# Altium schematic sheet [10] - CONNECTOR.SchDoc
size A4; Size: A4; Contact: datasystem.pl
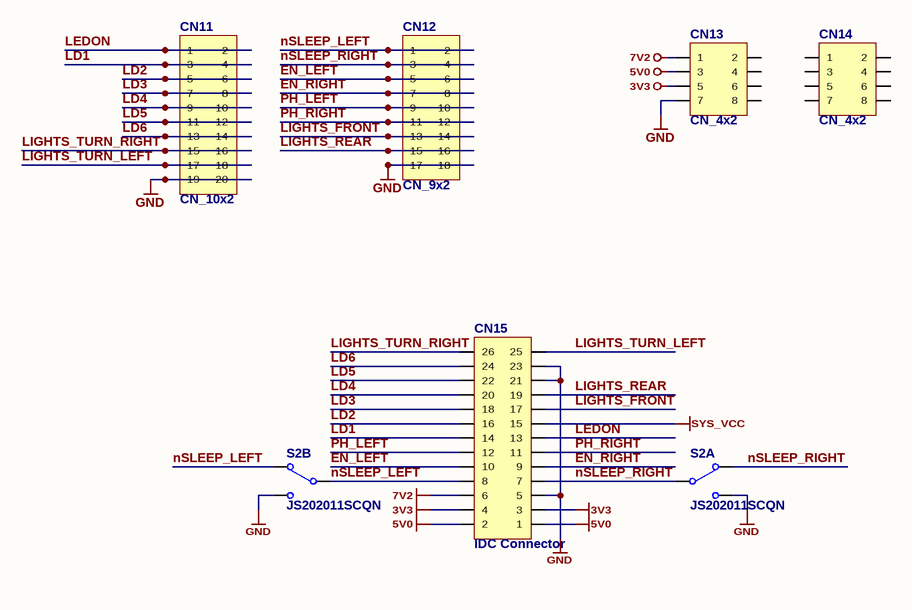
[diagram p0: [10] - CONNECTOR.SchDoc]

## Parts
CN11  CN_10x2  [GP_10x2]
CN12  CN_9x2  [GP_9x2]
CN13  CN_4x2  [GP_4x2]
CN14  CN_4x2  [GP_4x2]
CN15  IDC Connector  [IDC26_RA]
S2  JS202011SCQN  [JS202011SCQN]  (parts A,B of 2)

## Nets
3V3: CN13.5 CN15.3 CN15.4
5V0: CN13.3 CN15.1 CN15.2
7V2: CN13.1 CN15.6
GND: CN11.19 CN11.20 CN12.17 CN12.18 CN13.7 CN15.5 CN15.21 CN15.23 S2.3(NO1) S2.6(NO2)
SYS_VCC: CN15.15
EN_LEFT: CN12.5 CN12.6 CN15.10
EN_RIGHT: CN12.7 CN12.8 CN15.9
LD1: CN11.3 CN11.4 CN15.14
LD2: CN11.5 CN11.6 CN15.16
LD3: CN11.7 CN11.8 CN15.18
LD4: CN11.9 CN11.10 CN15.20
LD5: CN11.11 CN11.12 CN15.22
LD6: CN11.13 CN11.14 CN15.24
LEDON: CN11.1 CN11.2 CN15.13
LIGHTS_FRONT: CN12.13 CN12.14 CN15.17
LIGHTS_REAR: CN12.15 CN12.16 CN15.19
LIGHTS_TURN_LEFT: CN11.17 CN11.18 CN15.25
LIGHTS_TURN_RIGHT: CN11.15 CN11.16 CN15.26
nSLEEP_LEFT: CN12.1 CN12.2 CN15.8 S2.4(NC2) S2.5(COMMON2)
nSLEEP_RIGHT: CN12.3 CN12.4 CN15.7 S2.1(COMMON1) S2.2(NC1)
PH_LEFT: CN12.9 CN12.10 CN15.12
PH_RIGHT: CN12.11 CN12.12 CN15.11

Not connected (* = marked no-connect by the designer): CN13 2 4 6 8; CN14 1 2 3 4 5 6 7 8

## Notes on the sheet
- REV:
- A  P  P  R  O  V  E  D
- /
- Lodz University of Technology
- ul. Wolczanska 211/215
- 90-924 LODZ, POLAND
- Institute of Electronics
- Project name:
- Title:
- Author:
- Verified by:

## Library data of the parts
CN15 = CN_13x2
S2 = JS202011SCQN: C&K JS202011SCQN DPDT Switch; Published: 24-Mar-1999; Revision: July-2002: Re-released for DXP Platform.; Publisher: Altium Limited; Supplier 1: Farnell; Supplier 2: Farnell; Supplier Part Number 1: 2320019RL; Supplier Part Number 2: 2320019